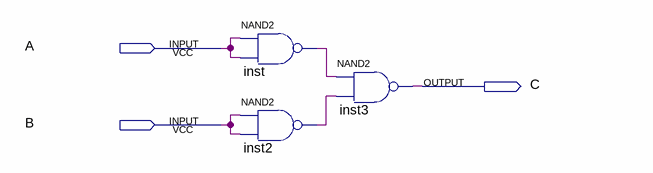
[diagram p0: schematic sheet]
// Quartus schematic or_nand2.bdf as structural Verilog: 3 symbols, 3 pins
module or_nand2 (
  input  A,
  input  B,
  output C
);

  wire inst2_out, inst_out;

  nand inst (inst_out, A, A);
  nand inst2 (inst2_out, B, B);
  nand inst3 (C, inst_out, inst2_out);
endmodule
